# Altium schematic sheet Ethernet.SchDoc
size A3; SheetNumber: 7; SheetTotal: 9
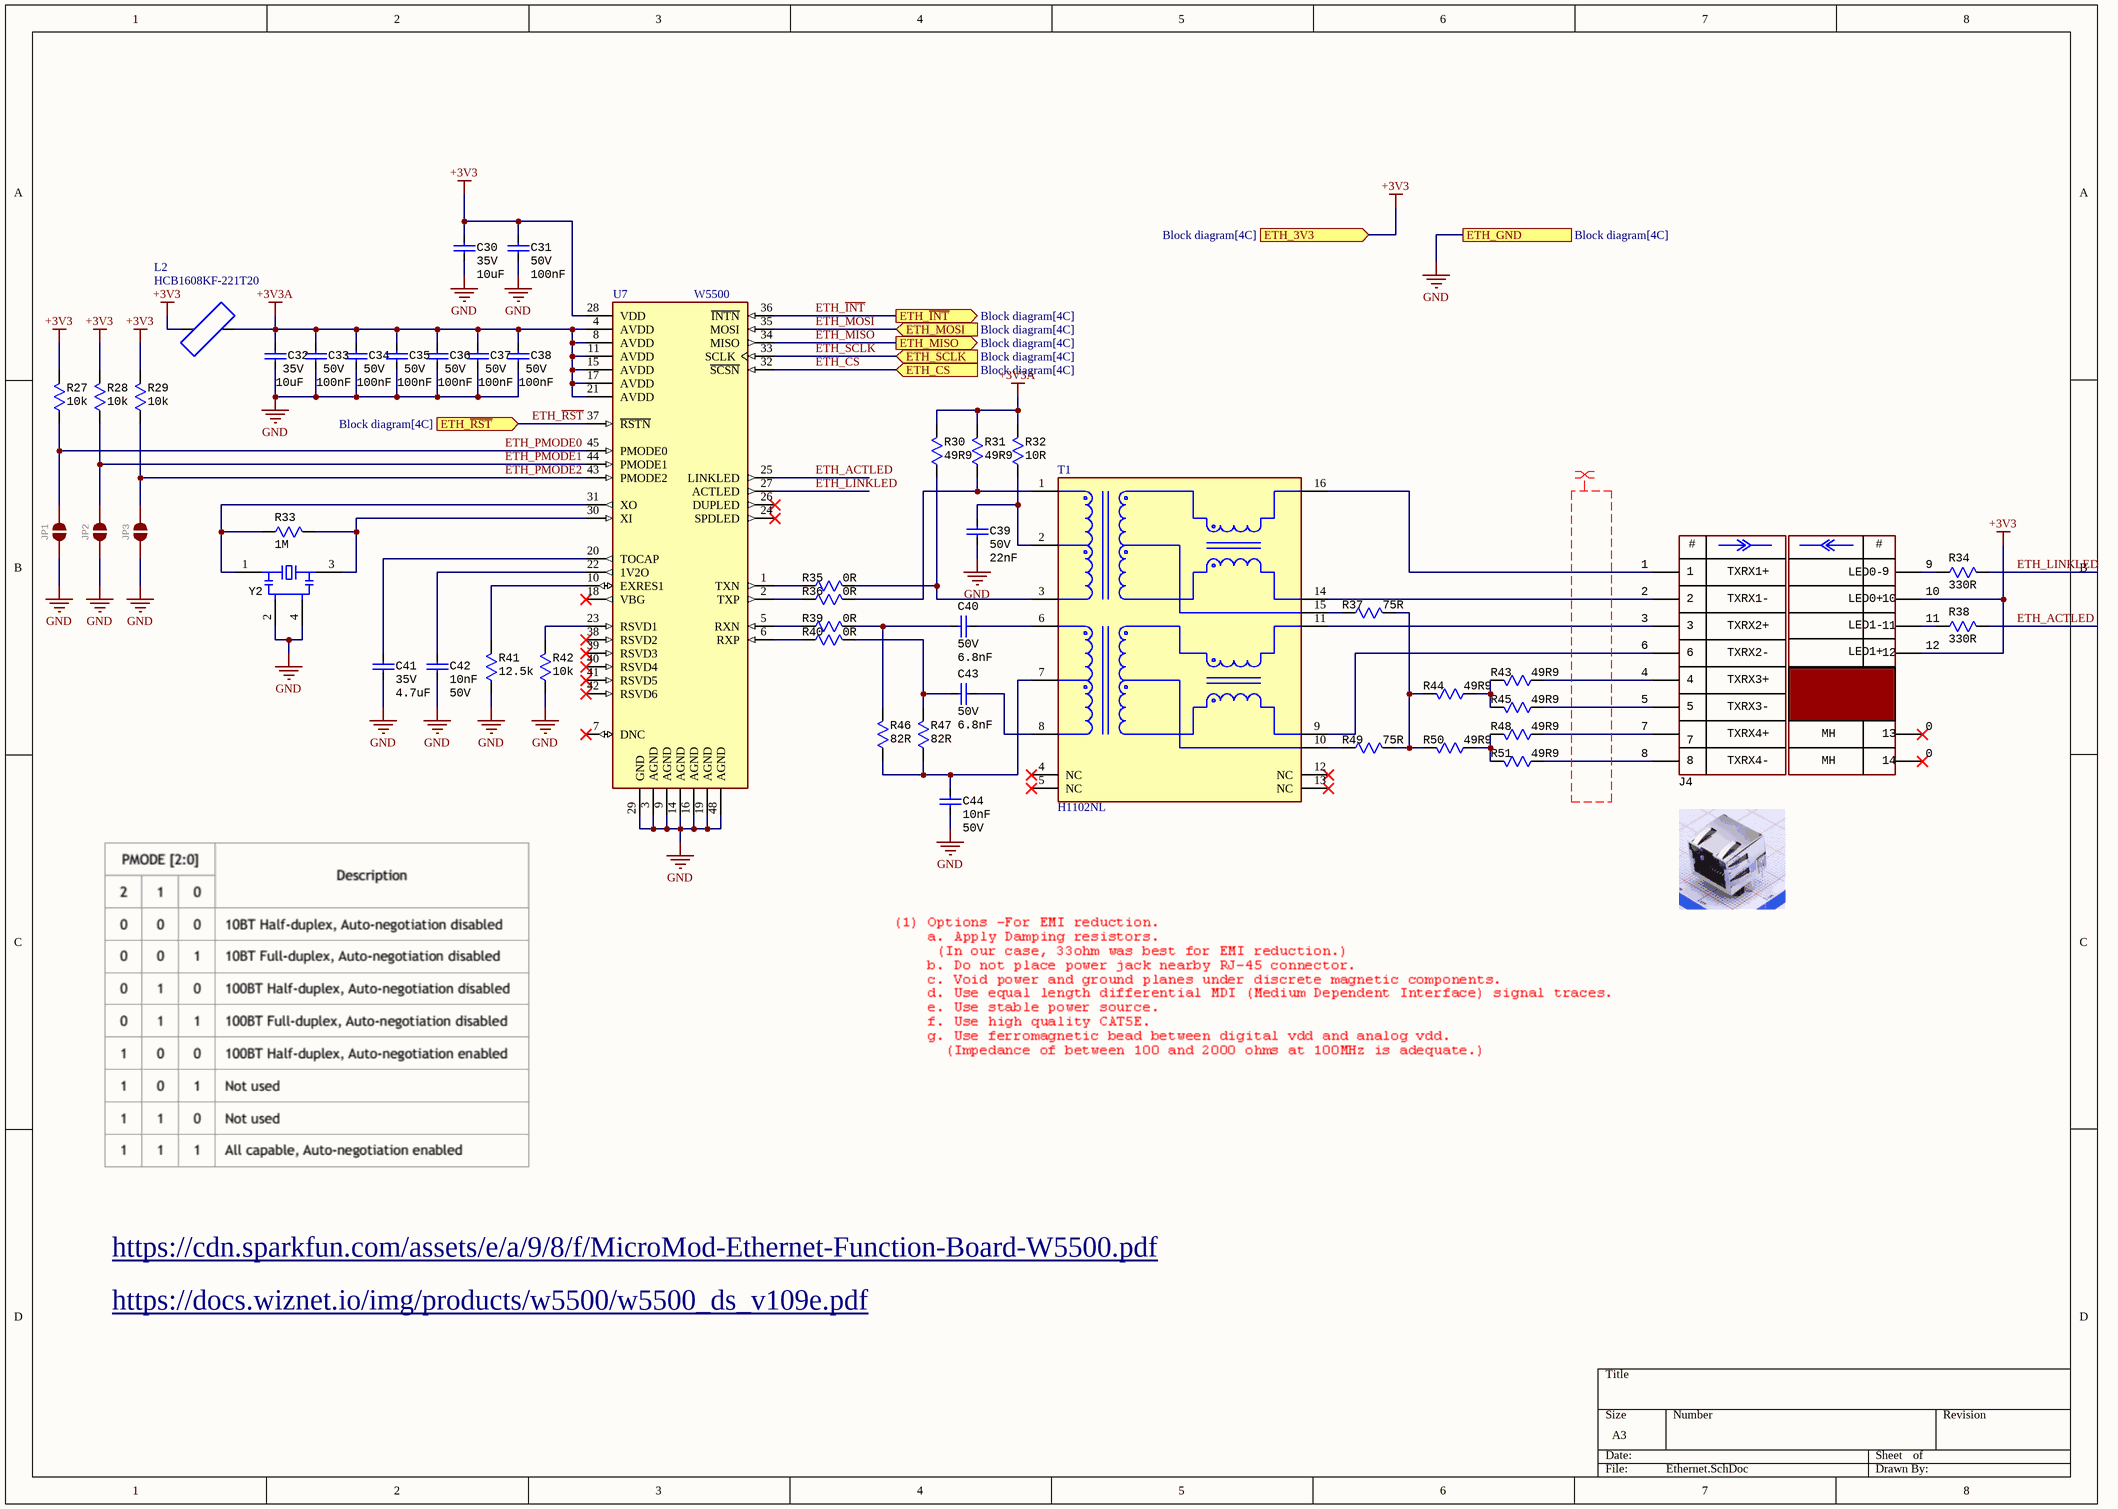
[diagram p0: Ethernet.SchDoc]

## Parts
C30  Voltage: 35V  [CAP Ceramic SMD 0603]  (hidden comment: 10uF)
C31  Voltage: 50V  [CAP Ceramic SMD 0603]  (hidden comment: 100nF)
C32  Voltage: 35V  [CAP Ceramic SMD 0603]  (hidden comment: 10uF)
C33  Voltage: 50V  [CAP Ceramic SMD 0603]  (hidden comment: 100nF)
C34  Voltage: 50V  [CAP Ceramic SMD 0603]  (hidden comment: 100nF)
C35  Voltage: 50V  [CAP Ceramic SMD 0603]  (hidden comment: 100nF)
C36  Voltage: 50V  [CAP Ceramic SMD 0603]  (hidden comment: 100nF)
C37  Voltage: 50V  [CAP Ceramic SMD 0603]  (hidden comment: 100nF)
C38  Voltage: 50V  [CAP Ceramic SMD 0603]  (hidden comment: 100nF)
C39  Voltage: 50V  [CAP Ceramic SMD 0603]  (hidden comment: 22nF)
C40  Voltage: 50V  [CAP Ceramic SMD 0603]  (hidden comment: 6.8nF)
C41  Voltage: 35V  [CAP Ceramic SMD 0603]  (hidden comment: 4.7uF)
C42  Voltage Rating: 50V  [CAP Ceramic SMD 0603]  (hidden comment: 10nF)
C43  Voltage: 50V  [CAP Ceramic SMD 0603]  (hidden comment: 6.8nF)
C44  Voltage Rating: 50V  [CAP Ceramic SMD 0603]  (hidden comment: 10nF)
J4  RJ45-B-1*1  [Connector RJ-45 (615008137421 / DS1128-09-S8B8S)]  (value not drawn)
JP1  JUMPER-SMT_2_NO_SILK_ROUND  [SMT-JUMPER_2_NO_SILK_ROUND]  (value not drawn)
JP2  JUMPER-SMT_2_NO_SILK_ROUND  [SMT-JUMPER_2_NO_SILK_ROUND]  (value not drawn)
JP3  JUMPER-SMT_2_NO_SILK_ROUND  [SMT-JUMPER_2_NO_SILK_ROUND]  (value not drawn)
L2  HCB1608KF-221T20  [HCB1608KF-221T20]
R27  value 10k  [RES SMD 0603]  (hidden comment: 10kR)
R28  value 10k  [RES SMD 0603]  (hidden comment: 10kR)
R29  value 10k  [RES SMD 0603]  (hidden comment: 10kR)
R30  value 49R9  [RES SMD 0603]  (hidden comment: 49.9R)
R31  value 49R9  [RES SMD 0603]  (hidden comment: 49.9R)
R32  10R  [RES SMD 0603]
R33  value 1M  [RES SMD 0603]  (hidden comment: 1MR)
R34  330R  [RES SMD 0603]
R35  0R  [RES SMD 0603]
R36  0R  [RES SMD 0603]
R37  75R  [RES SMD 0603]
R38  330R  [RES SMD 0603]
R39  0R  [RES SMD 0603]
R40  0R  [RES SMD 0603]
R41  value 12.5k  [RES SMD 0603]  (hidden comment: 12.4kR)
R42  value 10k  [RES SMD 0603]  (hidden comment: 10kR)
R43  value 49R9  [RES SMD 0603]  (hidden comment: 49.9R)
R44  value 49R9  [RES SMD 0603]  (hidden comment: 49.9R)
R45  value 49R9  [RES SMD 0603]  (hidden comment: 49.9R)
R46  82R  [RES SMD 0603]
R47  82R  [RES SMD 0603]
R48  value 49R9  [RES SMD 0603]  (hidden comment: 49.9R)
R49  75R  [RES SMD 0603]
R50  value 49R9  [RES SMD 0603]  (hidden comment: 49.9R)
R51  value 49R9  [RES SMD 0603]  (hidden comment: 49.9R)
T1  H1102NL  [FP-H1102NL-MFG]
U7  W5500  [QFP50P900X900X160-48N]
Y2  X322525MRB4SI  [Crystal SMD 4-PIN 3225]  (value not drawn)

## Ports
ETH_3V3 (in, see Block diagram[4C]), ETH_CS (in, see Block diagram[4C]), ETH_GND (see Block diagram[4C]), ETH_MISO (out, see Block diagram[4C]), ETH_MOSI (in, see Block diagram[4C]), ETH_SCLK (in, see Block diagram[4C]), ETH_~{INT} (out, see Block diagram[4C]), ETH_~{RST} (in, see Block diagram[4C])

## Nets
+3V3: C30.1 C31.1 J4.10 J4.12 L2.2 R27.2 R28.2 R29.2 U7.28(VDD) ; port ETH_3V3
+3V3A: C32.1 C33.1 C34.1 C35.1 C36.1 C37.1 C38.1 L2.1 R30.2 R31.2 R32.2 U7.4(AVDD) U7.8(AVDD) U7.11(AVDD) U7.15(AVDD) U7.17(AVDD) U7.21(AVDD)
GND: C30.2 C31.2 C32.2 C33.2 C34.2 C35.2 C36.2 C37.2 C38.2 C39.2 C41.2 C42.2 C44.2 JP1.1 JP2.1 JP3.1 R41.1 R42.1 U7.3(AGND) U7.9(AGND) U7.14(AGND) U7.16(AGND) U7.19(AGND) U7.29(GND) U7.48(AGND) Y2.2(NC) Y2.4 ; port ETH_GND
ETH_ACTLED: R38.2 U7.25(LINKLED)
ETH_CS: U7.32(~{SCSN}) ; port ETH_CS
ETH_~{INT}: U7.36(~{INTN}) ; port ETH_~{INT}
ETH_LINKLED: R34.2 U7.27(ACTLED)
ETH_MISO: U7.34(MISO) ; port ETH_MISO
ETH_MOSI: U7.35(MOSI) ; port ETH_MOSI
ETH_PMODE0: JP1.2 R27.1 U7.45(PMODE0)
ETH_PMODE1: JP2.2 R28.1 U7.44(PMODE1)
ETH_PMODE2: JP3.2 R29.1 U7.43(PMODE2)
ETH_~{RST}: U7.37(~{RSTN}) ; port ETH_~{RST}
ETH_SCLK: U7.33(SCLK) ; port ETH_SCLK
NetC39_1: C39.1 R32.1 T1.2(CT)
NetC40_1: C40.1 R39.2 R46.2
NetC40_2: C40.2 T1.6(RD+)
NetC41_1: C41.1 U7.20(TOCAP)
NetC42_1: C42.1 U7.22(1V2O)
NetC43_1: C43.1 R40.2 R47.2
NetC43_2: C43.2 T1.8(RD-)
NetC44_1: C44.1 R46.1 R47.1 T1.7(CT)
NetJ4_1: J4.1 T1.16(TX+)
NetJ4_2: J4.2 T1.14(TX-)
NetJ4_3: J4.3 T1.11(RX+)
NetJ4_4: J4.4 R43.1
NetJ4_5: J4.5 R45.1
NetJ4_6: J4.6 T1.9(RX-)
NetJ4_7: J4.7 R48.1
NetJ4_8: J4.8 R51.1
NetJ4_9: J4.9 R34.1
NetJ4_11: J4.11 R38.1
NetR30_1: R30.1 R35.2 T1.3(TD-)
NetR31_1: R31.1 R36.2 T1.1(TD+)
NetR33_1: R33.1 U7.31(XO) Y2.1
NetR33_2: R33.2 U7.30(XI) Y2.3(NC)
NetR35_1: R35.1 U7.1(TXN)
NetR36_1: R36.1 U7.2(TXP)
NetR37_1: R37.1 T1.15(NC)
NetR37_2: R37.2 R44.2 R49.2 R50.2
NetR39_1: R39.1 U7.5(RXN)
NetR40_1: R40.1 U7.6(RXP)
NetR41_2: R41.2 U7.10(EXRES1)
NetR42_2: R42.2 U7.23(RSVD1)
NetR43_2: R43.2 R44.1 R45.2
NetR48_2: R48.2 R50.1 R51.2
NetR49_1: R49.1 T1.10(NC)

Not connected (* = marked no-connect by the designer): J4 0*; T1 4(NC)* 5(NC)* 12(NC)* 13(NC)*; U7 7(DNC)* 18(VBG)* 24(SPDLED)* 26(DUPLED)* 38(RSVD2)* 39(RSVD3)* 40(RSVD4)* 41(RSVD5)* 42(RSVD6)*

## Layout directives
net class Diff100Ohm: (no net found under the mark)

## Notes on the sheet
- https://cdn.sparkfun.com/assets/e/a/9/8/f/MicroMod-Ethernet-Function-Board-W5500.pdf
- https://docs.wiznet.io/img/products/w5500/w5500_ds_v109e.pdf
- (in symbol RJ45-B-1*1) #; TXRX1+; LED0-; TXRX1-; LED0+; TXRX2+; LED1-; TXRX2-; LED1+; TXRX3+; TXRX3-; TXRX4+; MH; 13; TXRX4-; 14

## Library data of the parts
C30 C32 = CAP 0603 10uF 35V: Cap Ceramic 10uF 35V X5R 20% Pad SMD 0603 85C T/R; Manufacturer: Murata; Manufacturer Part Number: GRM188R6YA106MA73D; Supplier 1: LCSC; RoHS: Yes; Category: Ceramic Capacitors; Mount: Surface Mount; Case/Package: 0603; Case Code (Metric): 1608; Case Code (Imperial): 0603; Min Operating Temperature: -55°C; Max Operating Temperature: 85°C; Packaging: Tape and Reel; Capacitance: 10uF; Voltage Rating: 35V; Tolerance: 20%; Dielectric: X5R; Voltage Rating (DC): 35V; Length: 0.063inch; Width: 0.031inch; Thickness: 0.039inch; RoHS Compliant: Yes; ComponentLink1URL: http://search.murata.co.jp/Ceramy/image/img/A01X/G101/ENG/GRM188R6YA106MA73-01.pdf?src-supplier=Future+Electronics; ComponentLink1Description: http://search.murata.co.jp/Ceramy/image/img/A01X/G101/ENG/GRM188R6YA106MA73-01.pdf?src-supplier=Future+Electronics; ComponentLink2URL: http://search.murata.co.jp/Ceramy/image/img/A01X/G101/ENG/GRM188R6YA106MA73-01.pdf?src-supplier=Digi-Key; ComponentLink2Description: http://search.murata.co.jp/Ceramy/image/img/A01X/G101/ENG/GRM188R6YA106MA73-01.pdf?src-supplier=Digi-Key; ComponentLink3URL: https://www.murata.com/~/media/webrenewal/support/library/catalog/products/capacitor/mlcc/c02e.ashx?la=en-us&src-supplier=Digi-Key; ComponentLink3Description: https://www.murata.com/~/media/webrenewal/support/library/catalog/products/capacitor/mlcc/c02e.ashx?la=en-us&src-supplier=Digi-Key; ComponentLink4URL: http://search.murata.co.jp/Ceramy/image/img/A01X/G101/ENG/GRM188R6YA106MA73-01.pdf?src-supplier=Mouser; ComponentLink4Description: http://search.murata.co.jp/Ceramy/image/img/A01X/G101/ENG/GRM188R6YA106MA73-01.pdf?src-supplier=Mouser; ComponentLink5URL: http://search.murata.co.jp/Ceramy/image/img/A01X/G101/ENG/GRM188R6YA106MA73-01.pdf?src-supplier=TTI; ComponentLink5Description: http://search.murata.co.jp/Ceramy/image/img/A01X/G101/ENG/GRM188R6YA106MA73-01.pdf?src-supplier=TTI; Supplier Part Number 1: C194427; Value: 10uF
C31 C33-C38 = CAP 0603 100nF 50V: Multilayer Ceramic Capacitors MLCC Surface Mount 0603 0.1uF 50 Volts X7R 10%; Manufacturer: Murata; Manufacturer Part Number: GRM188R71H104KA93D; Insulation Resistance: 10GR; Supplier 1: LCSC; RoHS: Yes; Category: Ceramic Capacitors; Stock 1: 3546650; Pricing 1: 50=0.00420, 500=0.00330, 1500=0.00290, 5000=0.00260, 25000=0.00250, 50000=0.00240 (USD); Mount: Surface Mount; Case/Package: 0603; Number of Pins: 2; Case Code (Imperial): 0603; Case Code (Metric): 1608; Dielectric Material: Ceramic; Material: Ceramic; Contact Plating: Tin,Matte; Min Operating Temperature: -55°C; Max Operating Temperature: 125°C; Capacitance: 100nF; Tolerance: 10%; Packaging: Tape and Reel; Dielectric: X7R; Voltage Rating (DC): 50V; Termination: SMD/SMT; Package Quantity: 1; Voltage Rating: 50V; Length: 1.6mm; Width: 0.8mm; Height: 0.8mm; Depth: 0.8mm; Thickness: 0.035inch; Radiation Hardening: No; RoHS Compliant: Yes; REACH SVHC: No SVHC; Lead Free: Lead Free; ComponentLink1URL: https://datasheet.ciiva.com/19467/1857604-19467681.pdf?src-supplier=Jameco; ComponentLink1Description: https://datasheet.ciiva.com/19467/1857604-19467681.pdf?src-supplier=Jameco; ComponentLink2URL: https://datasheet.ciiva.com/11786/0900766b807a1cab-11786047.pdf?src-supplier=RSComponents; ComponentLink2Description: https://datasheet.ciiva.com/11786/0900766b807a1cab-11786047.pdf?src-supplier=RSComponents; ComponentLink3URL: https://datasheet.ciiva.com/29201/451744-da-01-en-vs-kondensator-0603-29201904.pdf?src-supplier=Conrad; ComponentLink3Description: https://datasheet.ciiva.com/29201/451744-da-01-en-vs-kondensator-0603-29201904.pdf?src-supplier=Conrad; ComponentLink4URL: https://datasheet.ciiva.com/7937/4360-7937659.pdf?src-supplier=Element14; ComponentLink4Description: https://datasheet.ciiva.com/7937/4360-7937659.pdf?src-supplier=Element14; ComponentLink5URL: https://datasheet.ciiva.com/14116/nmgrm-data-en-14116602.pdf?src-supplier=Distrelec; ComponentLink5Description: https://datasheet.ciiva.com/14116/nmgrm-data-en-14116602.pdf?src-supplier=Distrelec; ComponentLink6URL: https://datasheet.ciiva.com/48436/nmgrm-data-en-48436667.pdf?src-supplier=Distrelec; ComponentLink6Description: https://datasheet.ciiva.com/48436/nmgrm-data-en-48436667.pdf?src-supplier=Distrelec; ComponentLink7URL: https://datasheet.ciiva.com/28534/4360-28534245.pdf?src-supplier=Element14; ComponentLink7Description: https://datasheet.ciiva.com/28534/4360-28534245.pdf?src-supplier=Element14; ComponentLink8URL: https://datasheet.ciiva.com/131/partnumbering-e-01-131739.pdf?src-supplier=Digi-Key; ComponentLink8Description: https://datasheet.ciiva.com/131/partnumbering-e-01-131739.pdf?src-supplier=Digi-Key; ComponentLink9URL: https://datasheet.ciiva.com/131/partnumbering-e-01-131738.pdf?src-supplier=Digi-Key; ComponentLink9Description: https://datasheet.ciiva.com/131/partnumbering-e-01-131738.pdf?src-supplier=Digi-Key; ComponentLink10URL: https://datasheet.ciiva.com/131/partnumbering-e-01-131740.pdf?src-supplier=Digi-Key; ComponentLink10Description: https://datasheet.ciiva.com/131/partnumbering-e-01-131740.pdf?src-supplier=Digi-Key; ComponentLink11URL: https://datasheet.ciiva.com/7937/1747470-7937658.pdf?src-supplier=Element14; ComponentLink11Description: https://datasheet.ciiva.com/7937/1747470-7937658.pdf?src-supplier=Element14; Supplier Part Number 1: C77055; Value: 100nF
C39 = CAP 0603 22nF 50V: Ceramic capacitor SMD-0603 22nF /50V X7R# K +-10%, Samsung, RoHS; Manufacturer Part Number: CL10B223KB8NNNC; Tolerance: 10%; Dielectric: X7R; Supplier 1: LCSC; Supplier Part Number 1: C21122; Manufacturer: Samsung; RoHS: Yes; Category: Ceramic Capacitors; Stock 1: 380900; Pricing 1: 100=0.00480, 1000=0.00400, 4000=0.00360, 8000=0.00330, 48000=0.00310, 100000=0.00300 (USD); Mount: Surface Mount; Case/Package: 0603; Case Code (Metric): 1608; Case Code (Imperial): 0603; Contact Plating: Tin; Material: Ceramic; Min Operating Temperature: -55°C; Max Operating Temperature: 125°C; Voltage Rating (DC): 50V; Package Quantity: 1; Packaging: Tape and Reel; Voltage Rating: 50V; Series: CL; Construction: Flat; Length: 1.6mm; Width: 0.031inch; Height: 0.8mm; Thickness: 0.035inch; Depth: 0.8mm; Radiation Hardening: No; Lead Free: Lead Free; RoHS Compliant: Yes; ComponentLink1URL: https://datasheet.ciiva.com/25802/cl10b223kb8nnnc-25802289.pdf?src-supplier=Digi-Key; ComponentLink1Description: https://datasheet.ciiva.com/25802/cl10b223kb8nnnc-25802289.pdf?src-supplier=Digi-Key; ComponentLink2URL: https://datasheet.ciiva.com/26838/getdatasheetpartid-357419-26838449.pdf?src-supplier=Verical; ComponentLink2Description: https://datasheet.ciiva.com/26838/getdatasheetpartid-357419-26838449.pdf?src-supplier=Verical; ComponentLink3URL: https://datasheet.ciiva.com/29198/457190-da-01-en-vs-kondensator-0603-29198760.pdf?src-supplier=Conrad; ComponentLink3Description: https://datasheet.ciiva.com/29198/457190-da-01-en-vs-kondensator-0603-29198760.pdf?src-supplier=Conrad; ComponentLink4URL: https://datasheet.ciiva.com/26310/mlcc-catalogdownload2013-eng-26310316.pdf?src-supplier=Distrelec; ComponentLink4Description: https://datasheet.ciiva.com/26310/mlcc-catalogdownload2013-eng-26310316.pdf?src-supplier=Distrelec; ComponentLink5URL: https://datasheet.ciiva.com/16318/cl05b104kq5nnnc-16318246.pdf?src-supplier=Future+Electronics; ComponentLink5Description: https://datasheet.ciiva.com/16318/cl05b104kq5nnnc-16318246.pdf?src-supplier=Future+Electronics; Capacitance: 22nF
C40 C43 = CAP 0603 6.8nF 50V: Cap Ceramic 0.0068uF 50V X7R 5% SMD 0603 125°C Paper T/R; Manufacturer: Yageo; Part Number: CC0201KRX7R7BB103; Manufacturer Part Number: CL10B682JB8NNNC; Supplier: Digi-Key; Supplier Part Number: 311-1404-2-ND; Supplier 1: LCSC; Supplier Part Number 1: C307492; RoHS: Yes; Category: Ceramic Capacitors; Stock 1: 3000; Pricing 1: 100=0.00730, 1000=0.00590, 4000=0.00510, 8000=0.00460, 48000=0.00420, 100000=0.00400 (USD); Mount: Surface Mount; Case/Package: 0603; Case Code (Metric): 1608; Case Code (Imperial): 0603; Contact Plating: Tin,Matte; Min Operating Temperature: -55°C; Max Operating Temperature: 125°C; Tolerance: 5%; Packaging: Tape and Reel; Package Quantity: 1; Voltage Rating: 50V; Dielectric: X7R; Voltage Rating (DC): 50V; Series: CL; Construction: Flat; Length: 1.6mm; Width: 0.031inch; Height: 0.8mm; Thickness: 0.035inch; Depth: 0.8mm; Radiation Hardening: No; RoHS Compliant: Yes; ComponentLink1URL: https://datasheet.ciiva.com/25770/cl10b682jb8nnnc-25770152.pdf?src-supplier=Digi-Key; ComponentLink1Description: https://datasheet.ciiva.com/25770/cl10b682jb8nnnc-25770152.pdf?src-supplier=Digi-Key; ComponentLink2URL: https://datasheet.ciiva.com/26838/getdatasheetpartid-640154-26838477.pdf?src-supplier=Verical; ComponentLink2Description: https://datasheet.ciiva.com/26838/getdatasheetpartid-640154-26838477.pdf?src-supplier=Verical; Capacitance: 6.8nF
C41 = CAP 0603 4.7uF 35V: Multilayer Ceramic Capacitor, 4.7 uF, 35 V, ± 10%, X5R, 0603 [1608 Metric]; Manufacturer: Murata; Manufacturer Part Number: GRM188R6YA475KE15D; Supplier 1: LCSC; Supplier Part Number 1: C162274; RoHS: Yes; Category: Ceramic Capacitors; Stock 1: 52180; Pricing 1: 10=0.05850, 100=0.04900, 300=0.04430, 1000=0.03020, 4000=0.02820, 8000=0.02710 (USD); Mount: Surface Mount; Case/Package: 0603; Case Code (Metric): 1608; Case Code (Imperial): 0603; Weight: 0.000222oz; Material: Ceramic; Min Operating Temperature: -55°C; Max Operating Temperature: 85°C; Capacitance: 4.7uF; Tolerance: 10%; Voltage Rating: 35V; Packaging: Tape and Reel; Package Quantity: 1; Dielectric: X5R; Series: GRM; Voltage Rating (DC): 35V; Termination: SMD/SMT; Resistor Type: Ceramic; Length: 1.6mm; Width: 0.8mm; Height: 0.8mm; Thickness: 0.031inch; Depth: 0.8mm; RoHS Compliant: Yes; Lead Free: Lead Free; Reach SVHC Compliant: Yes; Value: 4.7uF
C42 C44 = CAP 0603 10nF 50V: 0603 10nF 50V ±10% Tolerance X7R Surface Mount Multilayer Ceramic Capacitor; Manufacturer: Kyocera AVX; Manufacturer Part Number: 06035C103K4T2A; Dissipation Factor: 2.5%; Supplier 1: LCSC; RoHS: Yes; Category: Ceramic Capacitors; Stock 1: 4600; Pricing 1: 50=0.012500, 500=0.010300, 1500=0.009100, 5000=0.008400, 25000=0.007800, 50000=0.007400 (AUD); Mount: Surface Mount; Case/Package: 0603; Number of Pins: 2; Case Code (Metric): 1608; Case Code (Imperial): 0603; Contact Plating: Tin,Matte; Min Operating Temperature: -55°C; Max Operating Temperature: 125°C; Tolerance: 10%; Packaging: Tape and Reel; Dielectric: X7R; Package Quantity: 1; Voltage Rating (DC): 50V; Termination: SMD/SMT; Series: -; Construction: Flat; Length: 1.6mm; Width: 0.032inch; Height: 0.9mm; Depth: 0.81mm; Thickness: 0.035inch; Ratings: AEC-Q200; Radiation Hardening: No; RoHS Compliant: Yes; Lead Free: Lead Free; REACH SVHC: No SVHC; ComponentLink1URL: https://datasheet.ciiva.com/16425/cauto-16425973.pdf?src-supplier=Future+Electronics; ComponentLink1Description: https://datasheet.ciiva.com/16425/cauto-16425973.pdf?src-supplier=Future+Electronics; ComponentLink2URL: https://datasheet.ciiva.com/206/cauto-206886.pdf?src-supplier=Digi-Key; ComponentLink2Description: https://datasheet.ciiva.com/206/cauto-206886.pdf?src-supplier=Digi-Key; ComponentLink3URL: https://datasheet.ciiva.com/7614/cauto-7614648.pdf?src-supplier=Digi-Key; ComponentLink3Description: https://datasheet.ciiva.com/7614/cauto-7614648.pdf?src-supplier=Digi-Key; ComponentLink4URL: https://datasheet.ciiva.com/14891/cauto-14891051.pdf?src-supplier=Digi-Key; ComponentLink4Description: https://datasheet.ciiva.com/14891/cauto-14891051.pdf?src-supplier=Digi-Key; ComponentLink5URL: https://datasheet.ciiva.com/7855/88813-7855228.pdf?src-supplier=Element14; ComponentLink5Description: https://datasheet.ciiva.com/7855/88813-7855228.pdf?src-supplier=Element14; ComponentLink6URL: https://datasheet.ciiva.com/14891/cauto-14891052.pdf?src-supplier=Digi-Key; ComponentLink6Description: https://datasheet.ciiva.com/14891/cauto-14891052.pdf?src-supplier=Digi-Key; ComponentLink7URL: https://datasheet.ciiva.com/11499/cauto-11499678.pdf?src-supplier=Avnet; ComponentLink7Description: https://datasheet.ciiva.com/11499/cauto-11499678.pdf?src-supplier=Avnet; Supplier Part Number 1: C513325; Capacitance: 10nF
J4 = RJ45-B-1*1: RJ45 RJReceptacle 1 Plugin Ethernet Connectors/Modular Connectors (RJ45 RJ11) ROHS; Manufacturer: BOOMELE(Boom Precision Elec); ManufacturerPartNumber: RJ45-B-1*1; TypeConnector: RJ45; SupplierPartNumber: C138392; Supplier: LCSC
JP1-JP3 = JUMPER-SMT_2_NO_SILK_ROUND: Normally open jumper    This jumper has two pads in close proximity to each other. Apply solder to close the connection.   Round pads are easier to solder for beginners, but are a lot larger.   SparkFun Product that uses the round pads:  SparkFun EL Sequencer; GateName_1: G$1; SymbolName_1: SMT-JUMPER_2_NO; DeviceName: _SILK_ROUND; LibraryName: SparkFun-Jumpers; DeviceSetName: JUMPER-SMT_2_NO; Package: SMT-JUMPER_2_NO_SILK_ROUND
L2 = Ferrite-Bead: 2A 1 100mΩ 220Ω@100MHz ±25% 0603 Ferrite Beads ROHS; Manufacturer: TAI-TECH; Part Number: HCB1608KF-221T20; Supplier: LCSC; Supplier part number: C304314; Package: 0603; ComponentLink1Description: LCSC; ComponentLink1URL: https://www.lcsc.com/product-detail/Ferrite-Beads_TAI-TECH-HCB1608KF-221T20_C304314.html
R27-R29 R42 = RES 0603 10k 1%: Res Thick Film 0603 10K Ohm 1% 1/10W ±100ppm/°C Molded SMD Punched Carrier T/R; Manufacturer: Panasonic; Manufacturer Part Number: ERJ-3EKF1002V; Max Power Dissipation: 100mW; Voltage Rating: 75V; Supplier 1: LCSC; RoHS: Yes; Category: Chip SMD Resistors; Stock 1: 555600; Pricing 1: 50=0.010200, 500=0.008400, 1500=0.007300, 5000=0.006100, 25000=0.005500, 50000=0.005400 (AUD); Mount: Surface Mount; Case/Package: 0603; Number of Pins: 2; Case Code (Metric): 1608; Case Code (Imperial): 0603; Contact Plating: Tin; Size Code: 0603; Min Operating Temperature: -55°C; Max Operating Temperature: 155°C; Resistance: 10kR; Packaging: Tape and Reel; Resistor Type: Thick Film; Temperature Coefficient: 100ppm/°C; Tolerance: 1%; Number of Terminations: 2; Series: ERJ; Construction: Rectangular; Power Rating: 100mW; Features: Automotive AEC-Q200; Voltage Rating (DC): 75V; Package Quantity: 1; Resistance Tolerance: 1%; Termination: SMD/SMT; Technology: THICK FILM; Length: 1.6mm; Width: 0.031inch; Height: 0.45mm; Depth: 0.8mm; Radiation Hardening: No; RoHS Compliant: Yes; Military Standard: Not; Lead Free: Lead Free; REACH SVHC: No SVHC; ComponentLink1URL: https://datasheet.ciiva.com/7830/aoa0000ce2-7830729.pdf?src-supplier=Element14; ComponentLink1Description: https://datasheet.ciiva.com/7830/aoa0000ce2-7830729.pdf?src-supplier=Element14; ComponentLink2URL: https://datasheet.ciiva.com/46372/1678782-46372725.pdf?src-supplier=Element14; ComponentLink2Description: https://datasheet.ciiva.com/46372/1678782-46372725.pdf?src-supplier=Element14; ComponentLink3URL: https://datasheet.ciiva.com/28514/426256-28514198.pdf?src-supplier=Element14; ComponentLink3Description: https://datasheet.ciiva.com/28514/426256-28514198.pdf?src-supplier=Element14; ComponentLink4URL: https://datasheet.ciiva.com/24070/aoa0000ce2-24070318.pdf?src-supplier=Mouser; ComponentLink4Description: https://datasheet.ciiva.com/24070/aoa0000ce2-24070318.pdf?src-supplier=Mouser; ComponentLink5URL: https://datasheet.ciiva.com/16759/70260748-16759807.pdf?src-supplier=Allied+Electronics; ComponentLink5Description: https://datasheet.ciiva.com/16759/70260748-16759807.pdf?src-supplier=Allied+Electronics; ComponentLink6URL: https://datasheet.ciiva.com/9194/aoa0000ce2-9194199.pdf?src-supplier=Avnet; ComponentLink6Description: https://datasheet.ciiva.com/9194/aoa0000ce2-9194199.pdf?src-supplier=Avnet; ComponentLink7URL: https://datasheet.ciiva.com/48530/aoa0000ce2-48530988.pdf?src-supplier=Avnet; ComponentLink7Description: https://datasheet.ciiva.com/48530/aoa0000ce2-48530988.pdf?src-supplier=Avnet; ComponentLink8URL: https://datasheet.ciiva.com/30208/aoa0000ce2-30208985.pdf?src-supplier=Onlinecomponents.com; ComponentLink8Description: https://datasheet.ciiva.com/30208/aoa0000ce2-30208985.pdf?src-supplier=Onlinecomponents.com; Supplier Part Number 1: C191124
R30 R31 R43-R45 R48 R50 R51 = RES 0603 49R9 1%: Res General Purpose Thick Film 0603 49.9 Ohm 1% 1/10W ±100ppm/°C Molded SMD Paper T/R; Manufacturer: Yageo; Manufacturer Part Number: RC0603FR-0749R9L; Voltage Rating (DC): 50V; Power Rating: 100mW; ComponentLink6URL: https://datasheet.ciiva.com/16779/70260748-16779334.pdf?src-supplier=Allied+Electronics; ComponentLink6Description: https://datasheet.ciiva.com/16779/70260748-16779334.pdf?src-supplier=Allied+Electronics; ComponentLink7URL: https://datasheet.ciiva.com/16765/70260748-16765239.pdf?src-supplier=Allied+Electronics; ComponentLink7Description: https://datasheet.ciiva.com/16765/70260748-16765239.pdf?src-supplier=Allied+Electronics; ComponentLink8URL: https://datasheet.ciiva.com/30163/aoa0000ce2-30163966.pdf?src-supplier=Onlinecomponents.com; ComponentLink8Description: https://datasheet.ciiva.com/30163/aoa0000ce2-30163966.pdf?src-supplier=Onlinecomponents.com; Supplier Part Number 1: C114625; RoHS: Yes; Category: Chip SMD Resistors; Stock 1: 4057150; Pricing 1: 5000=0.00274, 10000=0.00238, 25000=0.00209, 50000=0.00192, 125000=0.00188 (USD); Case/Package: 0603; Number of Pins: 2; Case Code (Imperial): 0603; Case Code (Metric): 1608; Size Code: 0603; Min Operating Temperature: -55°C; Max Operating Temperature: 155°C; Tolerance: 1%; Resistance: 49.9R; Temperature Coefficient: 100ppm/°C; Resistor Type: Thick Film; Packaging: Tape and Reel; Voltage Rating: 50V; Termination: SMD/SMT; Features: Moisture Resistant; Series: RC; Max Power Dissipation: 100mW; Number of Terminations: 2; Construction: Rectangular; Resistance Tolerance: 1%; Technology: THICK FILM; Length: 1.6mm; Height: 0.45mm; Depth: 0.8mm; Lead Free: Lead Free; Reach SVHC Compliant: Yes; Military Standard: Not; RoHS Compliant: Yes; ComponentLink1URL: https://datasheet.ciiva.com/11808/0900766b80f96399-11808223.pdf?src-supplier=RSComponents; ComponentLink1Description: https://datasheet.ciiva.com/11808/0900766b80f96399-11808223.pdf?src-supplier=RSComponents; ComponentLink2URL: https://datasheet.ciiva.com/22747/443971-22747527.pdf?src-supplier=Element14; ComponentLink2Description: https://datasheet.ciiva.com/22747/443971-22747527.pdf?src-supplier=Element14; ComponentLink3URL: https://datasheet.ciiva.com/15189/getdatasheetpartid-325421-15189750.pdf?src-supplier=Verical; ComponentLink3Description: https://datasheet.ciiva.com/15189/getdatasheetpartid-325421-15189750.pdf?src-supplier=Verical; Supplier 1: LCSC
R32 = RES 0603 10R 1%: Res Thick Film 0603 10 Ohm 1% 1/10W ±200ppm/°C Molded SMD Paper T/R; Manufacturer: Yageo; Manufacturer Part Number: RC0603FR-0710RL; Voltage Rating (DC): 50V; Max Power Dissipation: 100mW; Supplier 1: Digi-Key; Supplier Part Number 1: 311-10.0HRDKR-ND; RoHS: Yes; Category: Chip SMD Resistors; Stock 1: 4513394; Pricing 1: 1=0.10000, 10=0.04200, 100=0.01700, 1000=0.00765, 2500=0.00664 (USD); Case/Package: 0603; Number of Pins: 2; Case Code (Imperial): 0603; Case Code (Metric): 1608; Size Code: 0603; Contact Plating: Tin,Matte; Min Operating Temperature: -55°C; Max Operating Temperature: 155°C; Packaging: Tape and Reel; Resistance: 10R; Tolerance: 1%; Resistor Type: Thick Film; Temperature Coefficient: 200ppm/°C; Features: Moisture Resistant; Series: RC; Number of Terminations: 2; Power Rating: 100mW; Construction: Rectangular; Voltage Rating: 50V; Termination: SMD/SMT; Resistance Tolerance: 1%; Technology: THICK FILM; Length: 1.6mm; Width: 0.8mm; Height: 0.45mm; Depth: 0.8mm; Radiation Hardening: No; Lead Free: Lead Free; RoHS Compliant: Yes; Military Standard: Not; Reach SVHC Compliant: Yes; ComponentLink1URL: https://datasheet.ciiva.com/11808/0900766b80f96399-11808140.pdf?src-supplier=RSComponents; ComponentLink1Description: https://datasheet.ciiva.com/11808/0900766b80f96399-11808140.pdf?src-supplier=RSComponents; ComponentLink2URL: https://datasheet.ciiva.com/7746/443971-7746245.pdf?src-supplier=Element14; ComponentLink2Description: https://datasheet.ciiva.com/7746/443971-7746245.pdf?src-supplier=Element14; ComponentLink3URL: https://datasheet.ciiva.com/8891/pyu-rc0603-51-rohs-l-4-8891285.pdf?src-supplier=Avnet; ComponentLink3Description: https://datasheet.ciiva.com/8891/pyu-rc0603-51-rohs-l-4-8891285.pdf?src-supplier=Avnet; Value: 10R
R33 = RES 0603 1M 1%: Res Thick Film 0603 1M Ohm 1% 1/10W ±100ppm/°C Molded SMD Punched Carrier T/R; Manufacturer: Vishay; Manufacturer Part Number: CRCW06031M00FKEA; Max Power Dissipation: 100mW; Voltage Rating (DC): 75V; Supplier 1: RSComponents; RoHS: Yes; Category: Chip SMD Resistors; Stock 1: 1700; Pricing 1: 50=0.05900, 500=0.05400, 1000=0.04900, 2000=0.04400, 4000=0.03800 (GBP); Mount: Surface Mount; Case/Package: 0603; Number of Pins: 2; Case Code (Imperial): 0603; Case Code (Metric): 1608; Contact Plating: Tin; Size Code: 0603; Weight: 7.1E-05oz; Min Operating Temperature: -55°C; Max Operating Temperature: 155°C; Tolerance: 1%; Packaging: Tape and Reel; Resistance: 1MR; Resistor Type: Thick Film; Number of Terminations: 2; Temperature Coefficient: 100ppm/°C; Series: CRCW; Package Quantity: 10; Power Rating: 100mW; Features: Automotive AEC-Q200; Voltage Rating: 75V; Construction: Rectangular; Termination: SMD/SMT; Resistance Tolerance: 1%; Technology: THICK FILM; Length: 1.55mm; Width: 0.85mm; Height: 0.45mm; Depth: 0.85mm; Radiation Hardening: No; RoHS Compliant: Yes; Lead Free: Lead Free; Military Standard: Not; REACH SVHC: Unknown; ComponentLink1URL: https://datasheet.ciiva.com/11809/0900766b80d98afc-11809074.pdf?src-supplier=RSComponents; ComponentLink1Description: https://datasheet.ciiva.com/11809/0900766b80d98afc-11809074.pdf?src-supplier=RSComponents; ComponentLink2URL: https://datasheet.ciiva.com/26314/fld-crcw-e3-data-en-26314645.pdf?src-supplier=Distrelec; ComponentLink2Description: https://datasheet.ciiva.com/26314/fld-crcw-e3-data-en-26314645.pdf?src-supplier=Distrelec; ComponentLink3URL: https://datasheet.ciiva.com/2465/dcrcwe3-2465549.pdf?src-supplier=Digi-Key; ComponentLink3Description: https://datasheet.ciiva.com/2465/dcrcwe3-2465549.pdf?src-supplier=Digi-Key; ComponentLink4URL: https://datasheet.ciiva.com/16311/dcrcwe3-16311533.pdf?src-supplier=Future+Electronics; ComponentLink4Description: https://datasheet.ciiva.com/16311/dcrcwe3-16311533.pdf?src-supplier=Future+Electronics; ComponentLink5URL: https://datasheet.ciiva.com/2465/dcrcwe3-2465550.pdf?src-supplier=Digi-Key; ComponentLink5Description: https://datasheet.ciiva.com/2465/dcrcwe3-2465550.pdf?src-supplier=Digi-Key; ComponentLink6URL: https://datasheet.ciiva.com/7841/1720486-7841822.pdf?src-supplier=Element14; ComponentLink6Description: https://datasheet.ciiva.com/7841/1720486-7841822.pdf?src-supplier=Element14; ComponentLink7URL: https://datasheet.ciiva.com/2465/dcrcwe3-2465551.pdf?src-supplier=Digi-Key; ComponentLink7Description: https://datasheet.ciiva.com/2465/dcrcwe3-2465551.pdf?src-supplier=Digi-Key; ComponentLink8URL: https://datasheet.ciiva.com/7841/125364-7841823.pdf?src-supplier=Element14; ComponentLink8Description: https://datasheet.ciiva.com/7841/125364-7841823.pdf?src-supplier=Element14; Supplier Part Number 1: 6789932; Supplier 2: LCSC; Stock 2: 440800; Pricing 2: 50=0.009700, 500=0.007800, 1500=0.006700, 5000=0.006100, 25000=0.005500, 50000=0.005200 (AUD); ComponentLink9URL: https://datasheet.ciiva.com/2432/aoa0000c304-2432473.pdf?src-supplier=Digi-Key; ComponentLink9Description: https://datasheet.ciiva.com/2432/aoa0000c304-2432473.pdf?src-supplier=Digi-Key; Supplier Part Number 2: C193390
R34 R38 = RES 0603 330R 1%: YAGEO (PHYCOMP) - RC0603FR-07330RL - RES, THICK FILM, 330R, 1%, 0.1W, 0603; Temperature Coefficient: 100ppm/°C; Voltage Rating (DC): 50V; Power Rating: 100mW; Supplier 1: LCSC; Supplier Part Number 1: C105881; Manufacturer: Yageo; Manufacturer Part Number: RC0603FR-07330RL; RoHS: Yes; Category: Chip SMD Resistors; Case/Package: 0603; Number of Pins: 2; Case Code (Metric): 1608; Case Code (Imperial): 0603; Size Code: 0603; Min Operating Temperature: -55°C; Max Operating Temperature: 155°C; Tolerance: 1%; Resistor Type: Thick Film; Packaging: Tape and Reel; Voltage Rating: 50V; Package Quantity: 1; Number of Terminations: 2; Termination: SMD/SMT; Max Power Dissipation: 100mW; Features: Moisture Resistant; Series: RC; Resistance Tolerance: 1%; Technology: THICK FILM; Length: 1.6mm; Width: 0.8mm; Height: 0.45mm; Depth: 0.8mm; Reach SVHC Compliant: Yes; Lead Free: Lead Free; RoHS Compliant: Yes; ComponentLink1URL: https://datasheet.ciiva.com/11819/0900766b80f96399-11819327.pdf?src-supplier=RSComponents; ComponentLink1Description: https://datasheet.ciiva.com/11819/0900766b80f96399-11819327.pdf?src-supplier=RSComponents; ComponentLink2URL: https://datasheet.ciiva.com/7746/1686128-7746331.pdf?src-supplier=Element14; ComponentLink2Description: https://datasheet.ciiva.com/7746/1686128-7746331.pdf?src-supplier=Element14; ComponentLink3URL: https://datasheet.ciiva.com/46440/1868787-46440904.pdf?src-supplier=Element14; ComponentLink3Description: https://datasheet.ciiva.com/46440/1868787-46440904.pdf?src-supplier=Element14; ComponentLink4URL: https://datasheet.ciiva.com/2454/pyu-r-int-thick-7-2454865.pdf?src-supplier=Digi-Key; ComponentLink4Description: https://datasheet.ciiva.com/2454/pyu-r-int-thick-7-2454865.pdf?src-supplier=Digi-Key; ComponentLink5URL: https://datasheet.ciiva.com/2454/pyu-r-int-thick-7-2454866.pdf?src-supplier=Digi-Key; ComponentLink5Description: https://datasheet.ciiva.com/2454/pyu-r-int-thick-7-2454866.pdf?src-supplier=Digi-Key; ComponentLink6URL: https://datasheet.ciiva.com/2454/pyu-r-int-thick-7-2454864.pdf?src-supplier=Digi-Key; ComponentLink6Description: https://datasheet.ciiva.com/2454/pyu-r-int-thick-7-2454864.pdf?src-supplier=Digi-Key; ComponentLink7URL: https://datasheet.ciiva.com/12555/rc0603-272842-12555334.pdf?src-supplier=Mouser; ComponentLink7Description: https://datasheet.ciiva.com/12555/rc0603-272842-12555334.pdf?src-supplier=Mouser; ComponentLink8URL: https://datasheet.ciiva.com/7746/443971-7746329.pdf?src-supplier=Element14; ComponentLink8Description: https://datasheet.ciiva.com/7746/443971-7746329.pdf?src-supplier=Element14; ComponentLink9URL: https://datasheet.ciiva.com/7746/443971-7746330.pdf?src-supplier=Element14; ComponentLink9Description: https://datasheet.ciiva.com/7746/443971-7746330.pdf?src-supplier=Element14; Resistance: 330R
R35 R36 R39 R40 = RES 0603 0R 1%: ERJ Series 0603 0 Ohm 0.05 W Jumper Surface Mount Thick Film Chip Resistor; Manufacturer: Panasonic; Manufacturer Part Number: ERJ-3GEY0R00V; Tolerance: 1%; Max Power Dissipation: 100mW; Voltage Rating (DC): 50V; Temperature Coefficient: 600ppm/°C; Voltage Rating: 75V; Supplier 1: Arrow Electronics; RoHS: Yes; Category: Chip SMD Resistors; Stock 1: 3440000; Pricing 1: 5000=0.00480 (USD); Mount: Surface Mount; Case/Package: 0603; Case Code (Metric): 1608; Case Code (Imperial): 0603; Contact Plating: Tin; Size Code: 0603; Min Operating Temperature: -55°C; Max Operating Temperature: 155°C; Packaging: Tape and Reel; Resistance: 0R; Resistor Type: Thick Film; Number of Terminations: 2; Series: ERJ; Power Rating: 100mW; Package Quantity: 1; Construction: Rectangular; Termination: SMD/SMT; Features: Automotive AEC-Q200; Technology: THICK FILM; Length: 1.6mm; Width: 0.031inch; Height: 0.45mm; Depth: 0.8mm; Radiation Hardening: No; RoHS Compliant: Yes; Lead Free: Lead Free; Military Standard: Not; REACH SVHC: No SVHC; ComponentLink1URL: https://datasheet.ciiva.com/27055/1935748-27055113.pdf?src-supplier=Jameco; ComponentLink1Description: https://datasheet.ciiva.com/27055/1935748-27055113.pdf?src-supplier=Jameco; ComponentLink2URL: https://datasheet.ciiva.com/11808/0900766b80f806dd-11808207.pdf?src-supplier=RSComponents; ComponentLink2Description: https://datasheet.ciiva.com/11808/0900766b80f806dd-11808207.pdf?src-supplier=RSComponents; ComponentLink3URL: https://datasheet.ciiva.com/48532/aoa0000ce1-48532165.pdf?src-supplier=Avnet; ComponentLink3Description: https://datasheet.ciiva.com/48532/aoa0000ce1-48532165.pdf?src-supplier=Avnet; ComponentLink4URL: https://datasheet.ciiva.com/43460/1678796-43460647.pdf?src-supplier=Farnell; ComponentLink4Description: https://datasheet.ciiva.com/43460/1678796-43460647.pdf?src-supplier=Farnell; ComponentLink5URL: https://datasheet.ciiva.com/28695/1678796-28695833.pdf?src-supplier=Element14; ComponentLink5Description: https://datasheet.ciiva.com/28695/1678796-28695833.pdf?src-supplier=Element14; ComponentLink6URL: https://datasheet.ciiva.com/5959/1678796-5959707.pdf?src-supplier=Farnell; ComponentLink6Description: https://datasheet.ciiva.com/5959/1678796-5959707.pdf?src-supplier=Farnell; ComponentLink7URL: https://datasheet.ciiva.com/16834/aoa0000ce1-16834828.pdf?src-supplier=Future+Electronics; ComponentLink7Description: https://datasheet.ciiva.com/16834/aoa0000ce1-16834828.pdf?src-supplier=Future+Electronics; ComponentLink8URL: https://datasheet.ciiva.com/46377/1678796-46377868.pdf?src-supplier=Element14; ComponentLink8Description: https://datasheet.ciiva.com/46377/1678796-46377868.pdf?src-supplier=Element14; ComponentLink9URL: https://datasheet.ciiva.com/30199/4aoa0000ce1-30199822.pdf?src-supplier=Onlinecomponents.com; ComponentLink9Description: https://datasheet.ciiva.com/30199/4aoa0000ce1-30199822.pdf?src-supplier=Onlinecomponents.com; ComponentLink10URL: https://datasheet.ciiva.com/9198/aoa0000ce1-9198975.pdf?src-supplier=Avnet; ComponentLink10Description: https://datasheet.ciiva.com/9198/aoa0000ce1-9198975.pdf?src-supplier=Avnet; ComponentLink11URL: https://datasheet.ciiva.com/16758/70255313-16758527.pdf?src-supplier=Allied+Electronics; ComponentLink11Description: https://datasheet.ciiva.com/16758/70255313-16758527.pdf?src-supplier=Allied+Electronics; Supplier Part Number 1: ERJ-3GEY0R00V; Supplier 2: LCSC; Stock 2: 79900; Pricing 2: 50=0.00820, 500=0.00670, 1500=0.00590, 5000=0.00540, 25000=0.00500, 50000=0.00480 (USD); ComponentLink12URL: https://datasheet.ciiva.com/22730/1678796-22730749.pdf?src-supplier=Element14; ComponentLink12Description: https://datasheet.ciiva.com/22730/1678796-22730749.pdf?src-supplier=Element14; Supplier Part Number 2: C716999; Value: 0R
R37 R49 = RES 0603 75R 1%: Resistor Thick Film 0603 75 Ohm 1% 1/10W 100ppm/C Molded SMD Punched Carrier T/R; Manufacturer: Panasonic; Manufacturer Part Number: ERJ-3EKF75R0V; Temperature Coefficient: 100ppm/°C; Max Power Dissipation: 100mW; Voltage Rating (DC): 50V; Voltage Rating: 75V; Supplier 1: LCSC; RoHS: Yes; Category: Chip SMD Resistors; Stock 1: 4800; Pricing 1: 50=0.00710, 500=0.00570, 1500=0.00490, 5000=0.00440, 25000=0.00400, 50000=0.00380 (USD); Mount: Surface Mount; Case/Package: 0603; Case Code (Metric): 1608; Case Code (Imperial): 0603; Contact Plating: Tin; Min Operating Temperature: -55°C; Max Operating Temperature: 155°C; Resistance: 75R; Tolerance: 1%; Packaging: Tape and Reel; Resistor Type: Thick Film; Number of Terminations: 2; Series: ERJ; Features: Automotive AEC-Q200; Package Quantity: 1; Power Rating: 100mW; Termination: SMD/SMT; Construction: Rectangular; Resistance Tolerance: 1%; Technology: THICK FILM; Working Voltage: 75V; Length: 1.6mm; Width: 0.8mm; Height: 0.45mm; Depth: 0.8mm; Radiation Hardening: No; RoHS Compliant: Yes; Lead Free: Lead Free; Military Standard: Not; Reach SVHC Compliant: Yes; ComponentLink1URL: https://datasheet.ciiva.com/27055/1988410-27055703.pdf?src-supplier=Jameco; ComponentLink1Description: https://datasheet.ciiva.com/27055/1988410-27055703.pdf?src-supplier=Jameco; ComponentLink2URL: https://datasheet.ciiva.com/43460/426256-43460430.pdf?src-supplier=Farnell; ComponentLink2Description: https://datasheet.ciiva.com/43460/426256-43460430.pdf?src-supplier=Farnell; ComponentLink3URL: https://datasheet.ciiva.com/5917/426256-5917836.pdf?src-supplier=Farnell; ComponentLink3Description: https://datasheet.ciiva.com/5917/426256-5917836.pdf?src-supplier=Farnell; ComponentLink4URL: https://datasheet.ciiva.com/46377/426256-46377003.pdf?src-supplier=Element14; ComponentLink4Description: https://datasheet.ciiva.com/46377/426256-46377003.pdf?src-supplier=Element14; ComponentLink5URL: https://datasheet.ciiva.com/22749/1678782-22749627.pdf?src-supplier=Element14; ComponentLink5Description: https://datasheet.ciiva.com/22749/1678782-22749627.pdf?src-supplier=Element14; ComponentLink6URL: https://datasheet.ciiva.com/28667/1678782-28667628.pdf?src-supplier=Element14; ComponentLink6Description: https://datasheet.ciiva.com/28667/1678782-28667628.pdf?src-supplier=Element14; ComponentLink7URL: https://datasheet.ciiva.com/24026/aoa0000ce2-24026441.pdf?src-supplier=Mouser; ComponentLink7Description: https://datasheet.ciiva.com/24026/aoa0000ce2-24026441.pdf?src-supplier=Mouser; ComponentLink8URL: https://datasheet.ciiva.com/16774/70260748-16774319.pdf?src-supplier=Allied+Electronics; ComponentLink8Description: https://datasheet.ciiva.com/16774/70260748-16774319.pdf?src-supplier=Allied+Electronics; ComponentLink9URL: https://datasheet.ciiva.com/9117/aoa0000ce2-9117161.pdf?src-supplier=Avnet; ComponentLink9Description: https://datasheet.ciiva.com/9117/aoa0000ce2-9117161.pdf?src-supplier=Avnet; ComponentLink10URL: https://datasheet.ciiva.com/48531/aoa0000ce2-48531543.pdf?src-supplier=Avnet; ComponentLink10Description: https://datasheet.ciiva.com/48531/aoa0000ce2-48531543.pdf?src-supplier=Avnet; ComponentLink11URL: https://datasheet.ciiva.com/30213/aoa0000ce2-30213401.pdf?src-supplier=Onlinecomponents.com; ComponentLink11Description: https://datasheet.ciiva.com/30213/aoa0000ce2-30213401.pdf?src-supplier=Onlinecomponents.com; ComponentLink12URL: https://datasheet.ciiva.com/15159/getdatasheetpartid-28796-15159205.pdf?src-supplier=Verical; ComponentLink12Description: https://datasheet.ciiva.com/15159/getdatasheetpartid-28796-15159205.pdf?src-supplier=Verical; Supplier Part Number 1: C403349; Value: 75R
R41 = RES 0603 12.5k 1%: Res Thick Film 0603 12.4K Ohm 1% 1/10W ±100ppm/°C Molded SMD SMD Paper Tape on Plastic Reel; Manufacturer: Bourns; Manufacturer Part Number: CR0603-FX-1242ELF; Max Power Dissipation: 100mW; Voltage Rating (DC): 50V; Supplier 1: LCSC; Supplier Part Number 1: C203273; RoHS: Yes; Category: Chip SMD Resistors; Stock 1: 200; Pricing 1: 50=0.00940, 500=0.00710, 1500=0.00560, 5000=0.00520, 25000=0.00480, 50000=0.00470 (USD); Mount: Surface Mount; Case/Package: 0603; Case Code (Metric): 1608; Case Code (Imperial): 0603; Contact Plating: Tin; Min Operating Temperature: -55°C; Max Operating Temperature: 155°C; Resistance: 12.4kR; Packaging: Tape and Reel; Tolerance: 1%; Temperature Coefficient: 100ppm/°C; Resistor Type: Thick Film; Number of Terminations: 2; Power Rating: 100mW; Series: CR0603; Voltage Rating: 50V; Package Quantity: 1; Termination: SMD/SMT; Features: Moisture Resistant; Resistance Tolerance: 1%; Construction: Rectangular; Length: 0.063inch; Width: 0.8mm; Height: 0.022inch; Depth: 0.8mm; Thickness: 457um; Radiation Hardening: No; RoHS Compliant: Yes; Military Standard: Not; Reach SVHC Compliant: Yes; ComponentLink1URL: https://datasheet.ciiva.com/5543/chpreztr-5543164.pdf?src-supplier=Mouser; ComponentLink1Description: https://datasheet.ciiva.com/5543/chpreztr-5543164.pdf?src-supplier=Mouser; ComponentLink2URL: https://datasheet.ciiva.com/7001/1902866-7001630.pdf?src-supplier=Newark; ComponentLink2Description: https://datasheet.ciiva.com/7001/1902866-7001630.pdf?src-supplier=Newark; ComponentLink3URL: https://datasheet.ciiva.com/18595/chpreztr-18595007.pdf?src-supplier=Digi-Key; ComponentLink3Description: https://datasheet.ciiva.com/18595/chpreztr-18595007.pdf?src-supplier=Digi-Key; ComponentLink4URL: https://datasheet.ciiva.com/46394/1791942-46394399.pdf?src-supplier=Element14; ComponentLink4Description: https://datasheet.ciiva.com/46394/1791942-46394399.pdf?src-supplier=Element14
R46 R47 = RES 0603 82R 1%: Res Thick Film 0603 82 Ohm 1% 0.1W(1/10W) ±100ppm/C Pad SMD T/R; Manufacturer: Yageo; Manufacturer Part Number: RC0603FR-0782RL; Power Rating: 100mW; Voltage Rating (DC): 50V; Temperature Coefficient: 100ppm/°C; Supplier 1: LCSC; Supplier Part Number 1: C137676; RoHS: Yes; Category: Chip SMD Resistors; Case/Package: 0603; Number of Pins: 2; Case Code (Metric): 1608; Case Code (Imperial): 0603; Size Code: 0603; Min Operating Temperature: -55°C; Max Operating Temperature: 155°C; Tolerance: 1%; Packaging: Tape and Reel; Voltage Rating: 50V; Package Quantity: 5000; Resistor Type: Thick Film; Number of Terminations: 2; Termination: SMD/SMT; Max Power Dissipation: 100mW; Features: Moisture Resistant; Series: RC; Resistance Tolerance: 1%; Length: 0.063inch; Width: 0.8mm; Height: 0.022inch; Depth: 0.8mm; Lead Free: Lead Free; RoHS Compliant: Yes; ComponentLink1URL: https://datasheet.ciiva.com/7746/443971-7746407.pdf?src-supplier=Element14; ComponentLink1Description: https://datasheet.ciiva.com/7746/443971-7746407.pdf?src-supplier=Element14; ComponentLink2URL: https://datasheet.ciiva.com/7746/443971-7746406.pdf?src-supplier=Element14; ComponentLink2Description: https://datasheet.ciiva.com/7746/443971-7746406.pdf?src-supplier=Element14; Resistance: 82R
T1 = H1102NLT: Telecom RJ45 Transformer 1:1/1:1 16Term. Gull Wing SMD; Manufacturer: Pulse; Insertion Loss: -1.1dB; DC Resistance (DCR): 650mR; Turns Ratio: 1:1; Shielding: Unshielded; Return Loss: -11.5dB; Isolation Voltage: 1.5kV; Termination: SMD/SMT; Packaging: Rail/Tube; Max Operating Temperature: 70°C; Height - Seated (Max): 6.22mm; Depth: 9.53mm; Number of Pins: 16; Package Quantity: 40; RoHS Compliant: Yes; Case/Package: Module; Radiation Hardening: No; Mount: Surface Mount; Width: 9.53m; Height: 6.09mm; Series: -; Lead/Base Style: Gull Wing; Length: 12.7mm; Lead Free: Lead Free; Min Operating Temperature: 0°C; Weight: 0.098767oz; Manufacturer Part Number: H1102NL; RoHS: Yes; Category: Transformers; ComponentLink1URL: https://datasheet.ciiva.com/2938/10-100base-tsingleportsmdmagnetics-rev2008-2938779.pdf?src-supplier=Digi-Key; ComponentLink1Description: https://datasheet.ciiva.com/2938/10-100base-tsingleportsmdmagnetics-rev2008-2938779.pdf?src-supplier=Digi-Key; Supplier 1: LCSC; Supplier Part Number 1: C18584
U7 = W5500: IC CTLR 3-1 ETH TCP/IP 48LQFP; Manufacturer: WIZnet; Max Supply Current: 132mA; Max Supply Voltage: 3.63V; Min Supply Voltage: 2.97V; Interface: SPI; Number of Transceivers: 1; Supplier 1: LCSC; Supplier Part Number 1: C32843; Manufacturer Part Number: W5500; RoHS: Yes; Category: Integrated Circuits (ICs); Stock 1: 80101; Pricing 1: 1=2.97820, 10=2.59000, 30=2.36100, 100=2.12710, 500=2.02050, 1000=1.97120 (USD); Case/Package: LQFP; Number of Pins: 48; Min Operating Temperature: -40°C; Max Operating Temperature: 85°C; Packaging: Tray; Package Quantity: 250; Operating Supply Current: 132mA; RoHS Compliant: Yes; Lead Free: Lead Free; ComponentLink1URL: https://datasheet.ciiva.com/29644/w5500-ds-v100e-29644866.pdf?src-supplier=Digi-Key; ComponentLink1Description: https://datasheet.ciiva.com/29644/w5500-ds-v100e-29644866.pdf?src-supplier=Digi-Key; ComponentLink2URL: https://datasheet.ciiva.com/24199/w5500-24199988.pdf?src-supplier=Future+Electronics; ComponentLink2Description: https://datasheet.ciiva.com/24199/w5500-24199988.pdf?src-supplier=Future+Electronics
Y2 = X322525MRB4SI: 25MHz SMD Crystal Resonator 18pF ±10ppm ±30ppm -40℃~+85℃ SMD3225-4P Crystals ROHS; Manufacturer: YXC; Supplier 1: LCSC; Supplier Part Number 1: C70593; Manufacturer Part Number: X322525MRB4SI; RoHS: No; Category: Uncategorized; Stock 1: 295; Pricing 1: 5=0.08190, 50=0.06600, 150=0.05800, 500=0.05200, 3000=0.04730, 6000=0.04490 (USD)